# Altium schematic sheet (2)power budget.SchDoc
size A; SheetNumber: 2; SheetTotal: 4
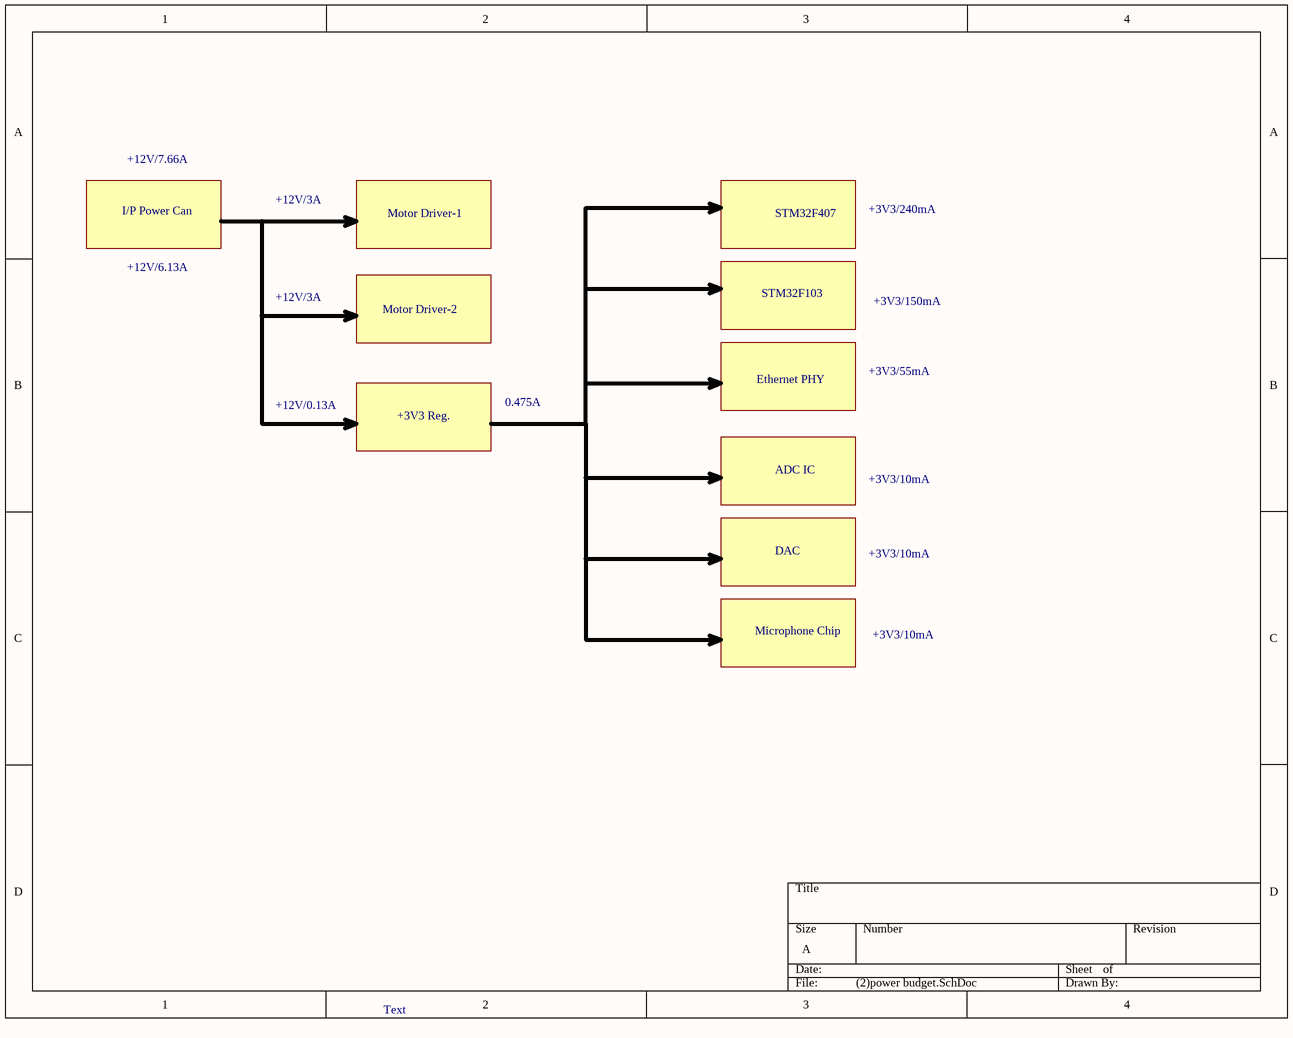
[diagram p0: (2)power budget.SchDoc]

## Notes on the sheet
- +12V/7.66A
- I/P Power Can
- +12V/3A
- Motor Driver-1
- STM32F407
- +3V3/240mA
- +12V/6.13A
- STM32F103
- Motor Driver-2
- +3V3/150mA
- +12V/0.13A
- +3V3 Reg.
- 0.475A
- Ethernet PHY
- +3V3/55mA
- ADC IC
- +3V3/10mA
- DAC
- Microphone Chip
- Text